# EasyEDA schematic SCH_CyBorg.json

## Sheets
1 CPU: TITLE: CyBorg - CPU, RAM, Bus; REV: 1.3; Date: 2022-11-21; Sheet: 1/6; Drawn By: Chris Brunner; Company: CyrusBuilt
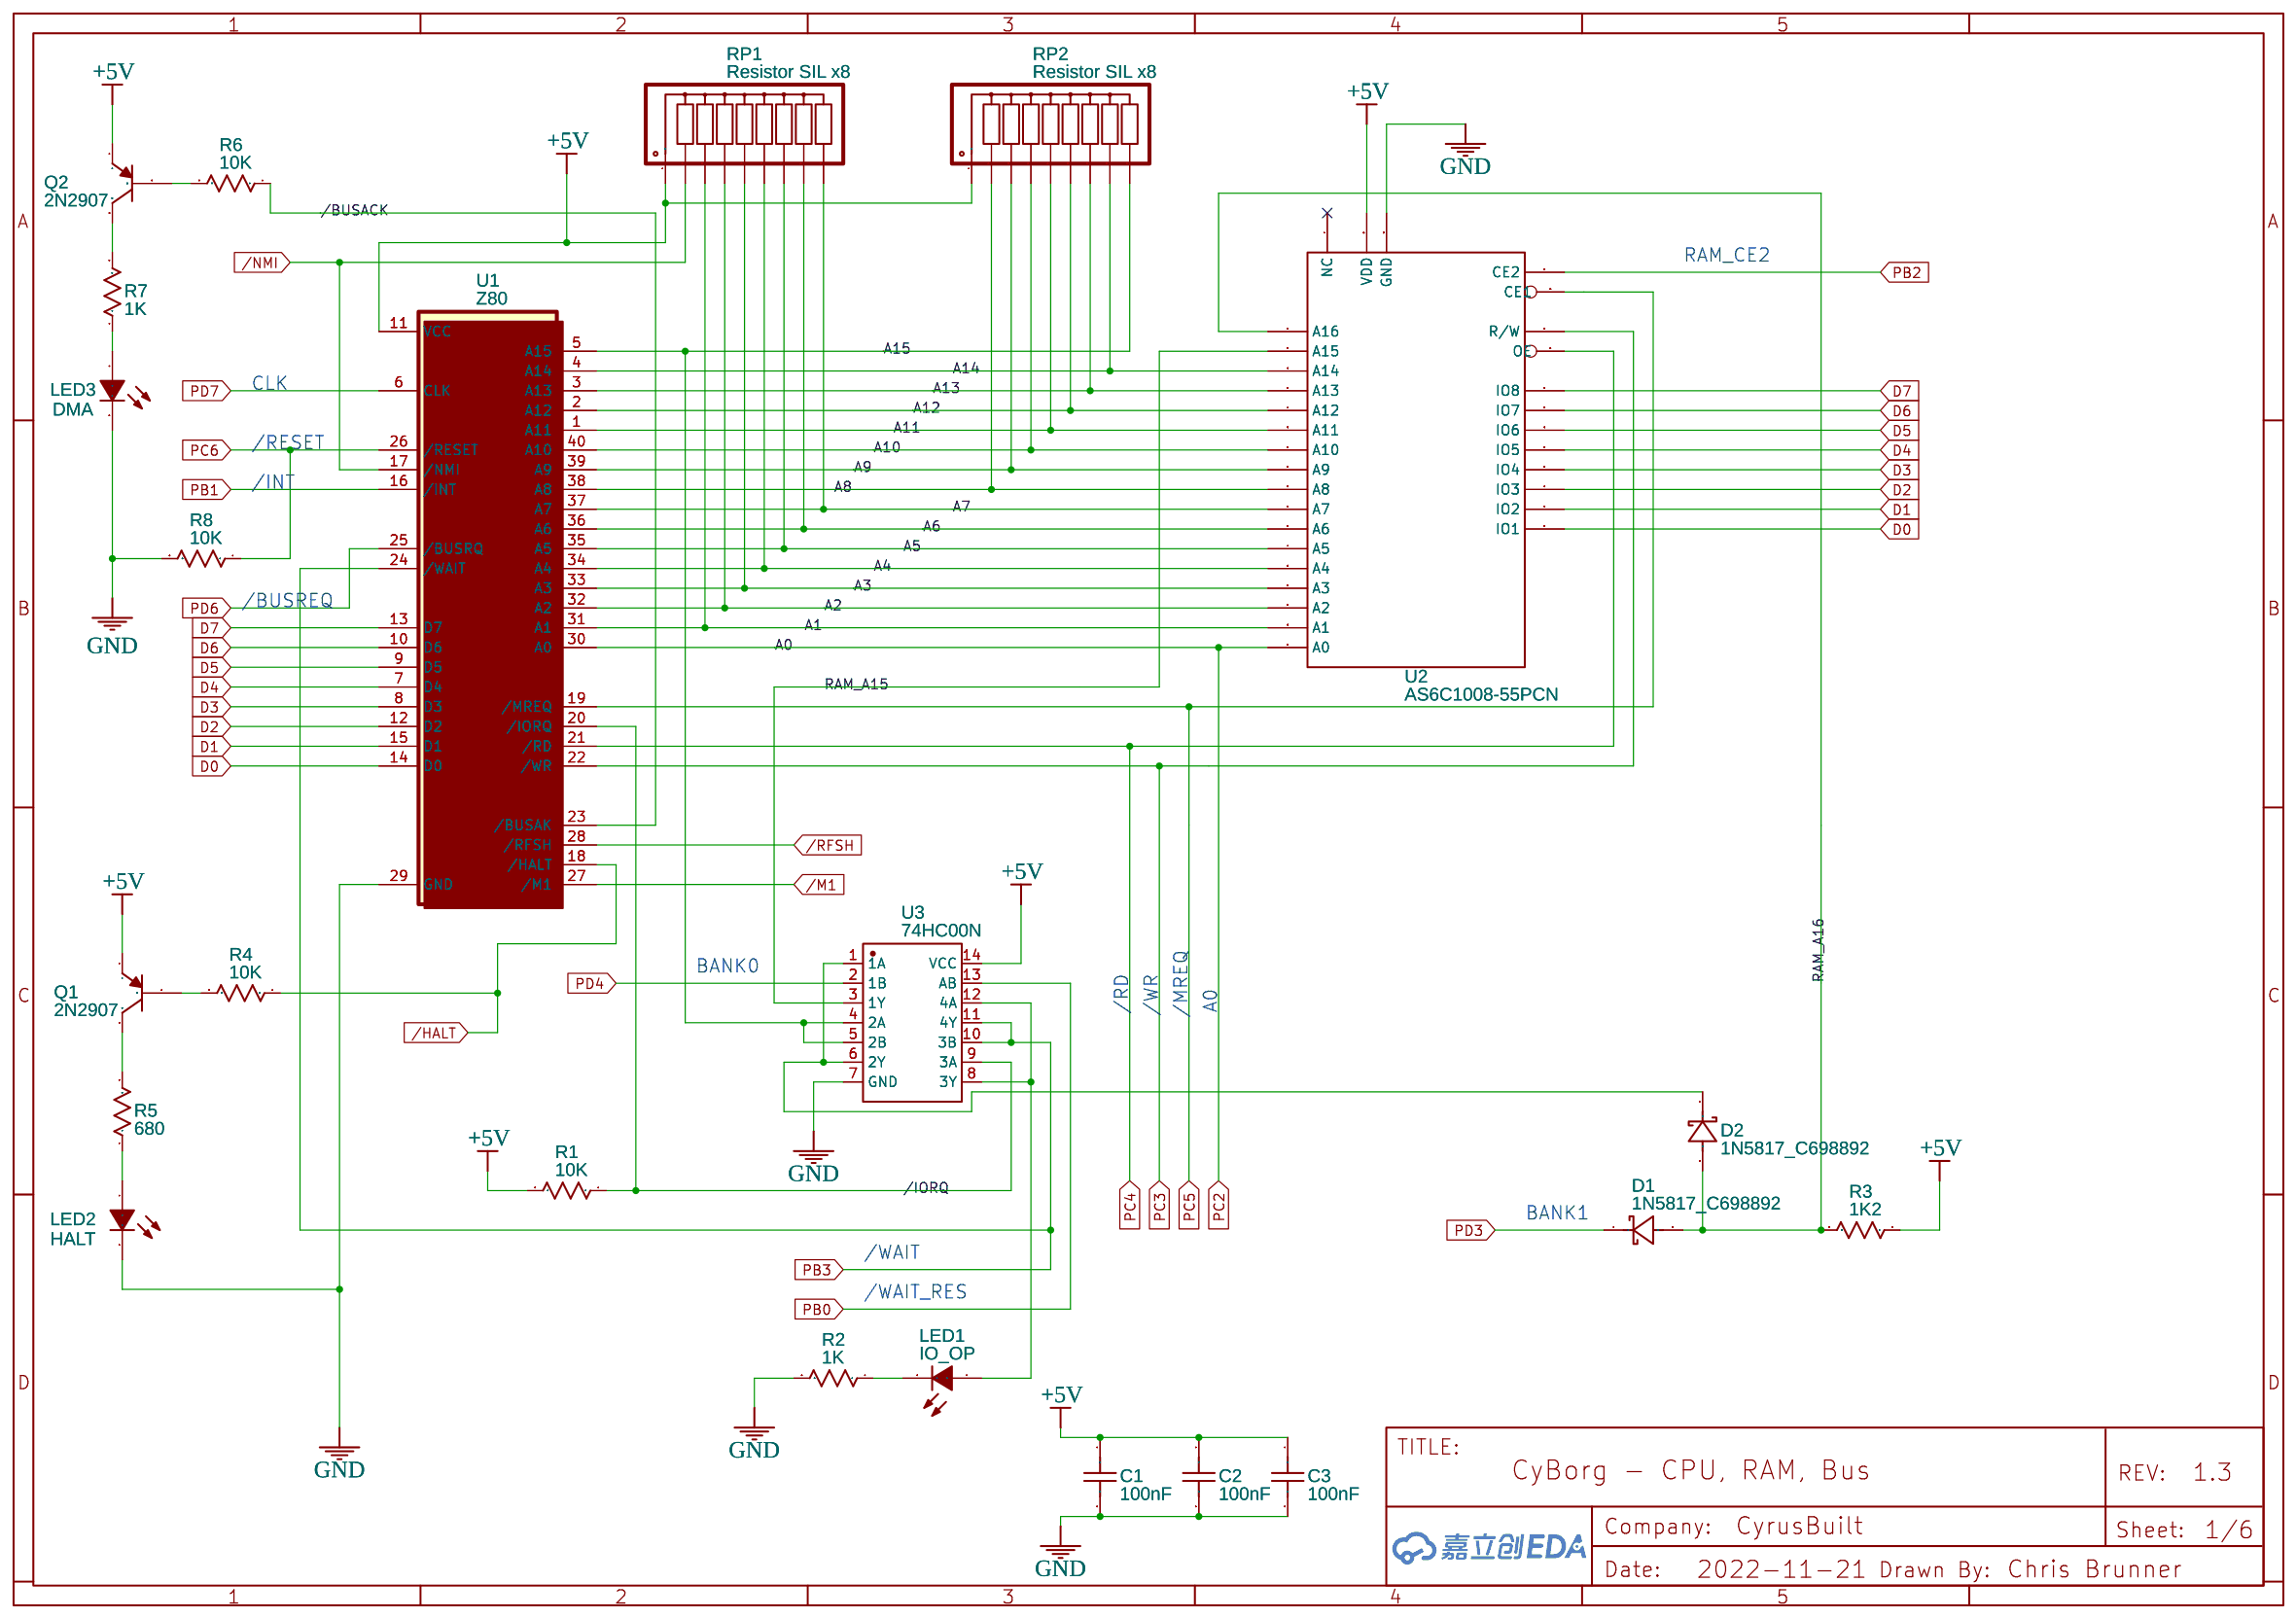
[diagram p0: CPU]
2 ViCREM: TITLE: CyBorg - ViCREM (Northbridge) and RTC; Date: 2022-11-22; Sheet: 2/6
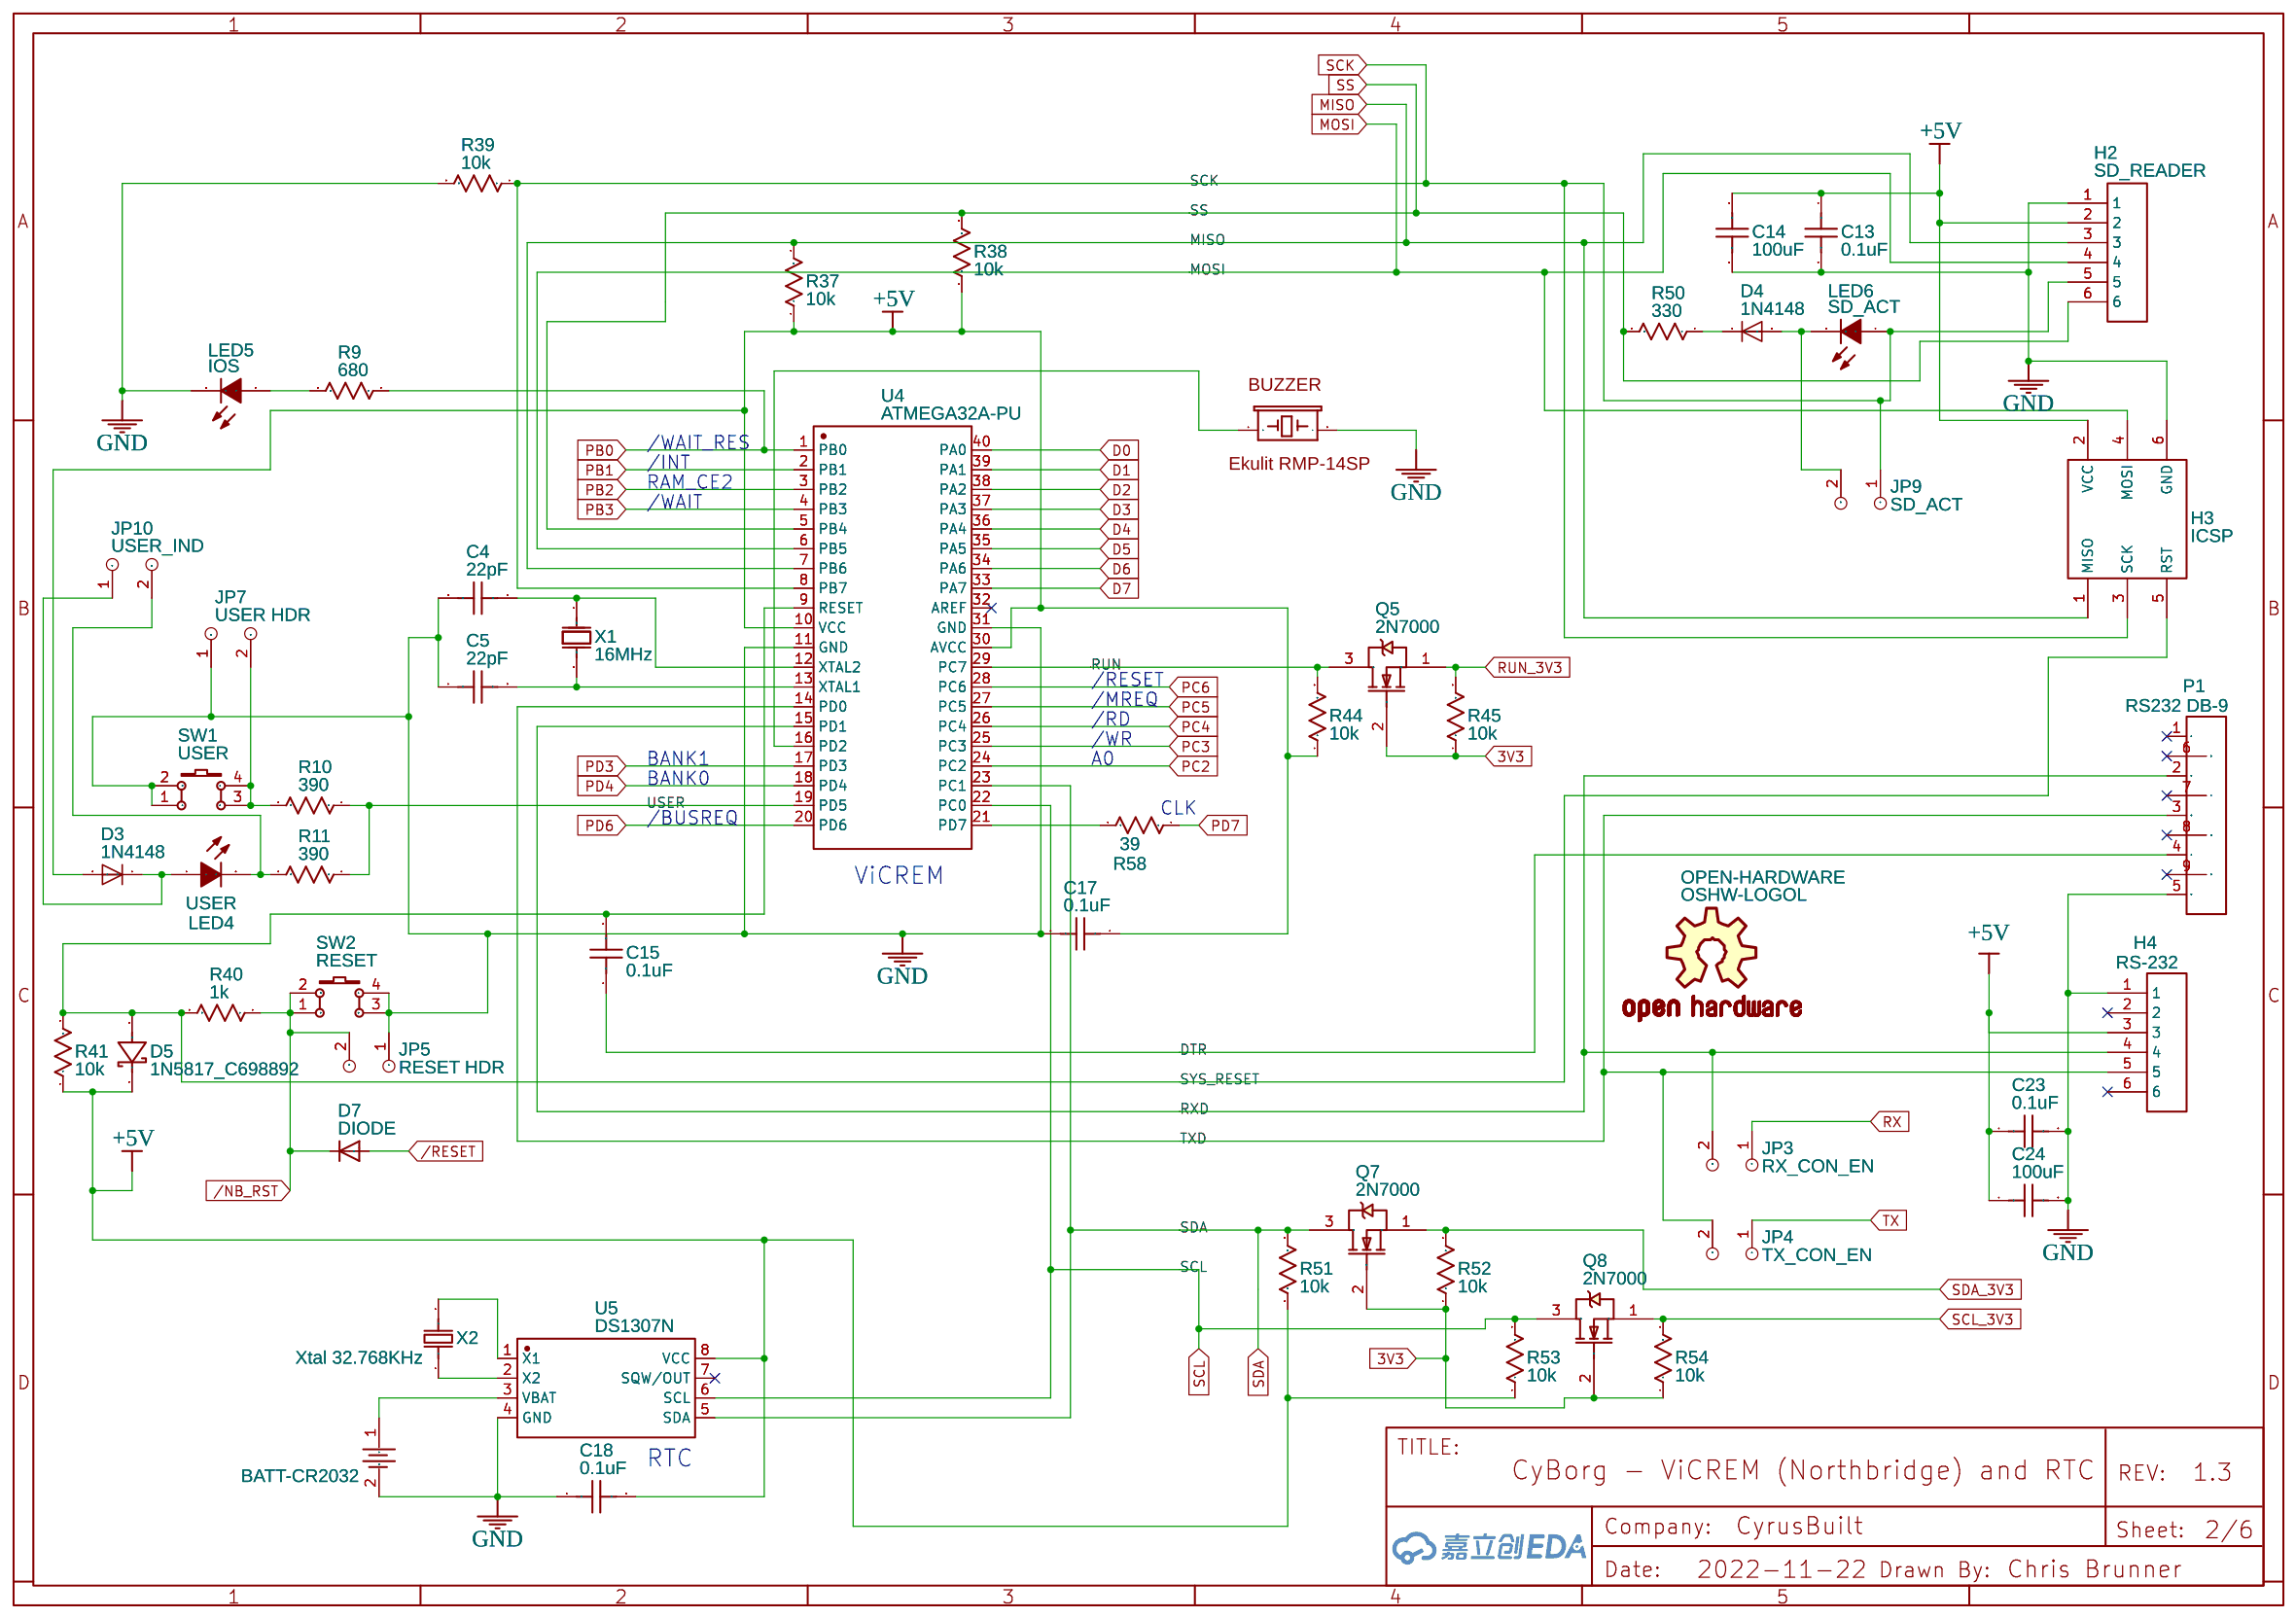
[diagram p1: ViCREM]
3 KAMVA - P1: TITLE: CyBorg - KAMVA (Southbridge) - MCU & VGA; Date: 2022-11-23; Sheet: 3/6
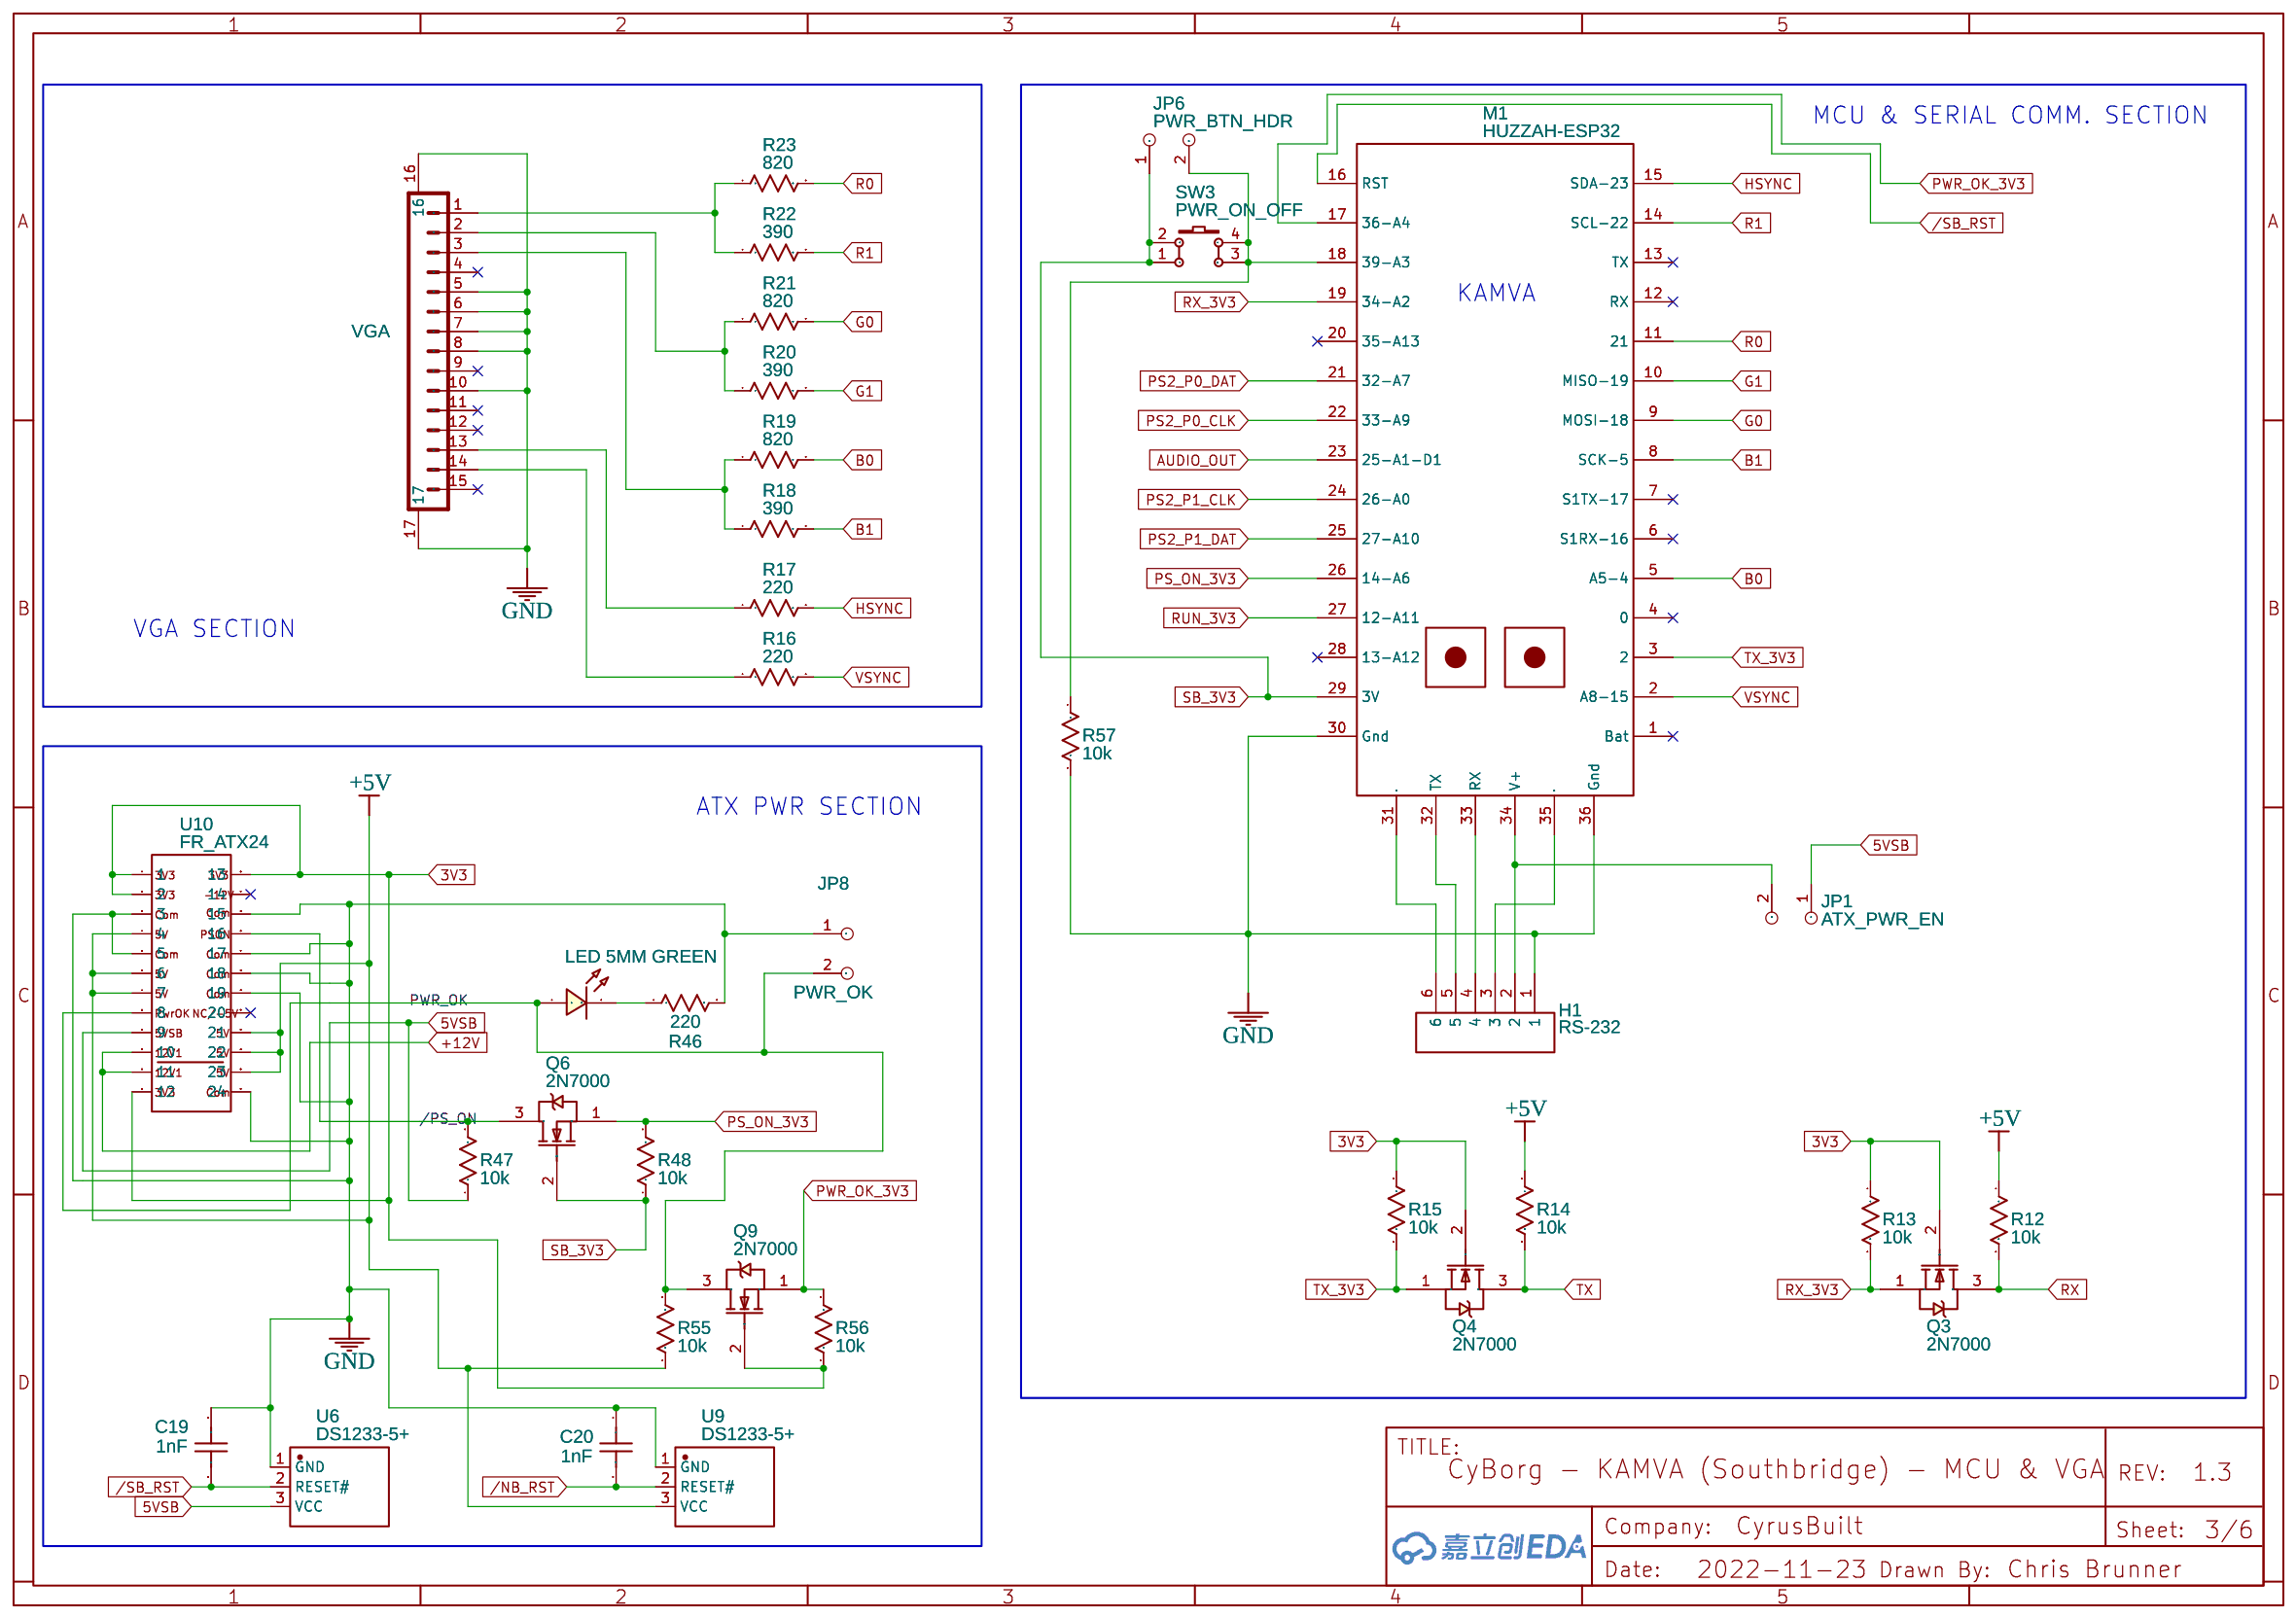
[diagram p2: KAMVA - P1]
4 KAMVA - P2: TITLE: CyBorg - KAMVA (Southbridge) - Audio & PS/2; Date: 2022-11-23; Sheet: 4/6
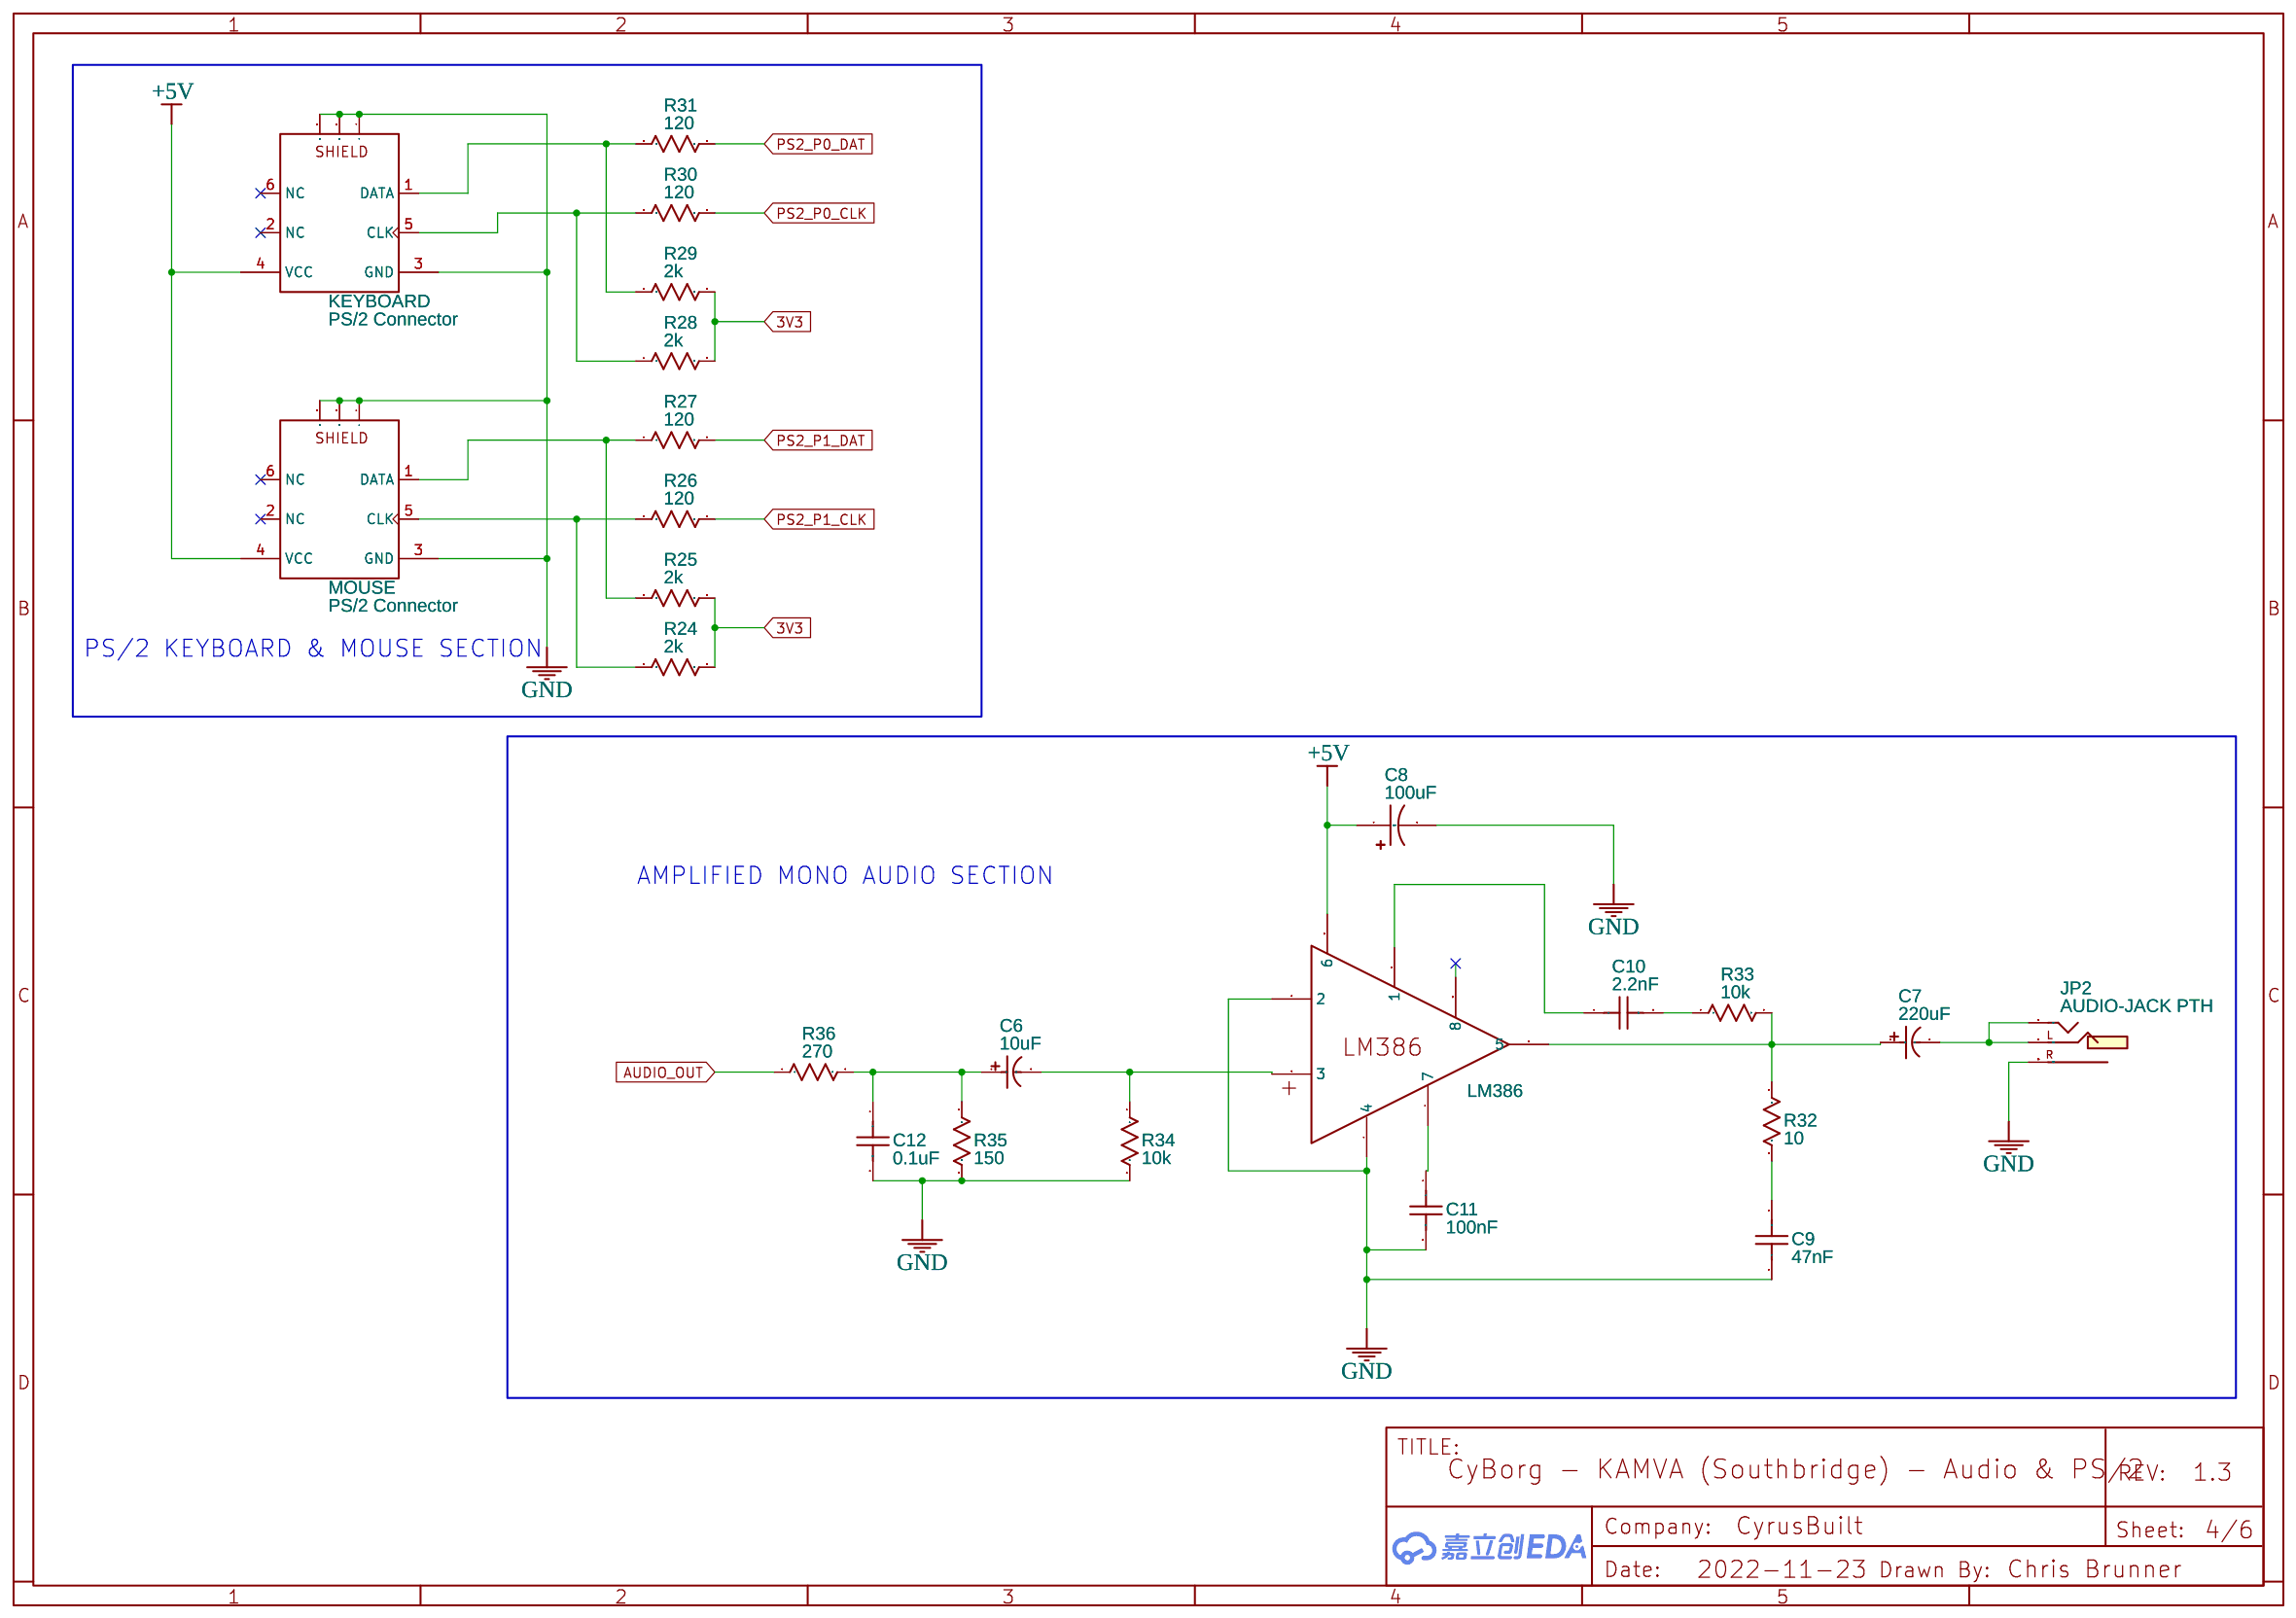
[diagram p3: KAMVA - P2]
5 Bus Control: TITLE: CyBorg - Bus Control; Date: 2022-11-24; Sheet: 5/6
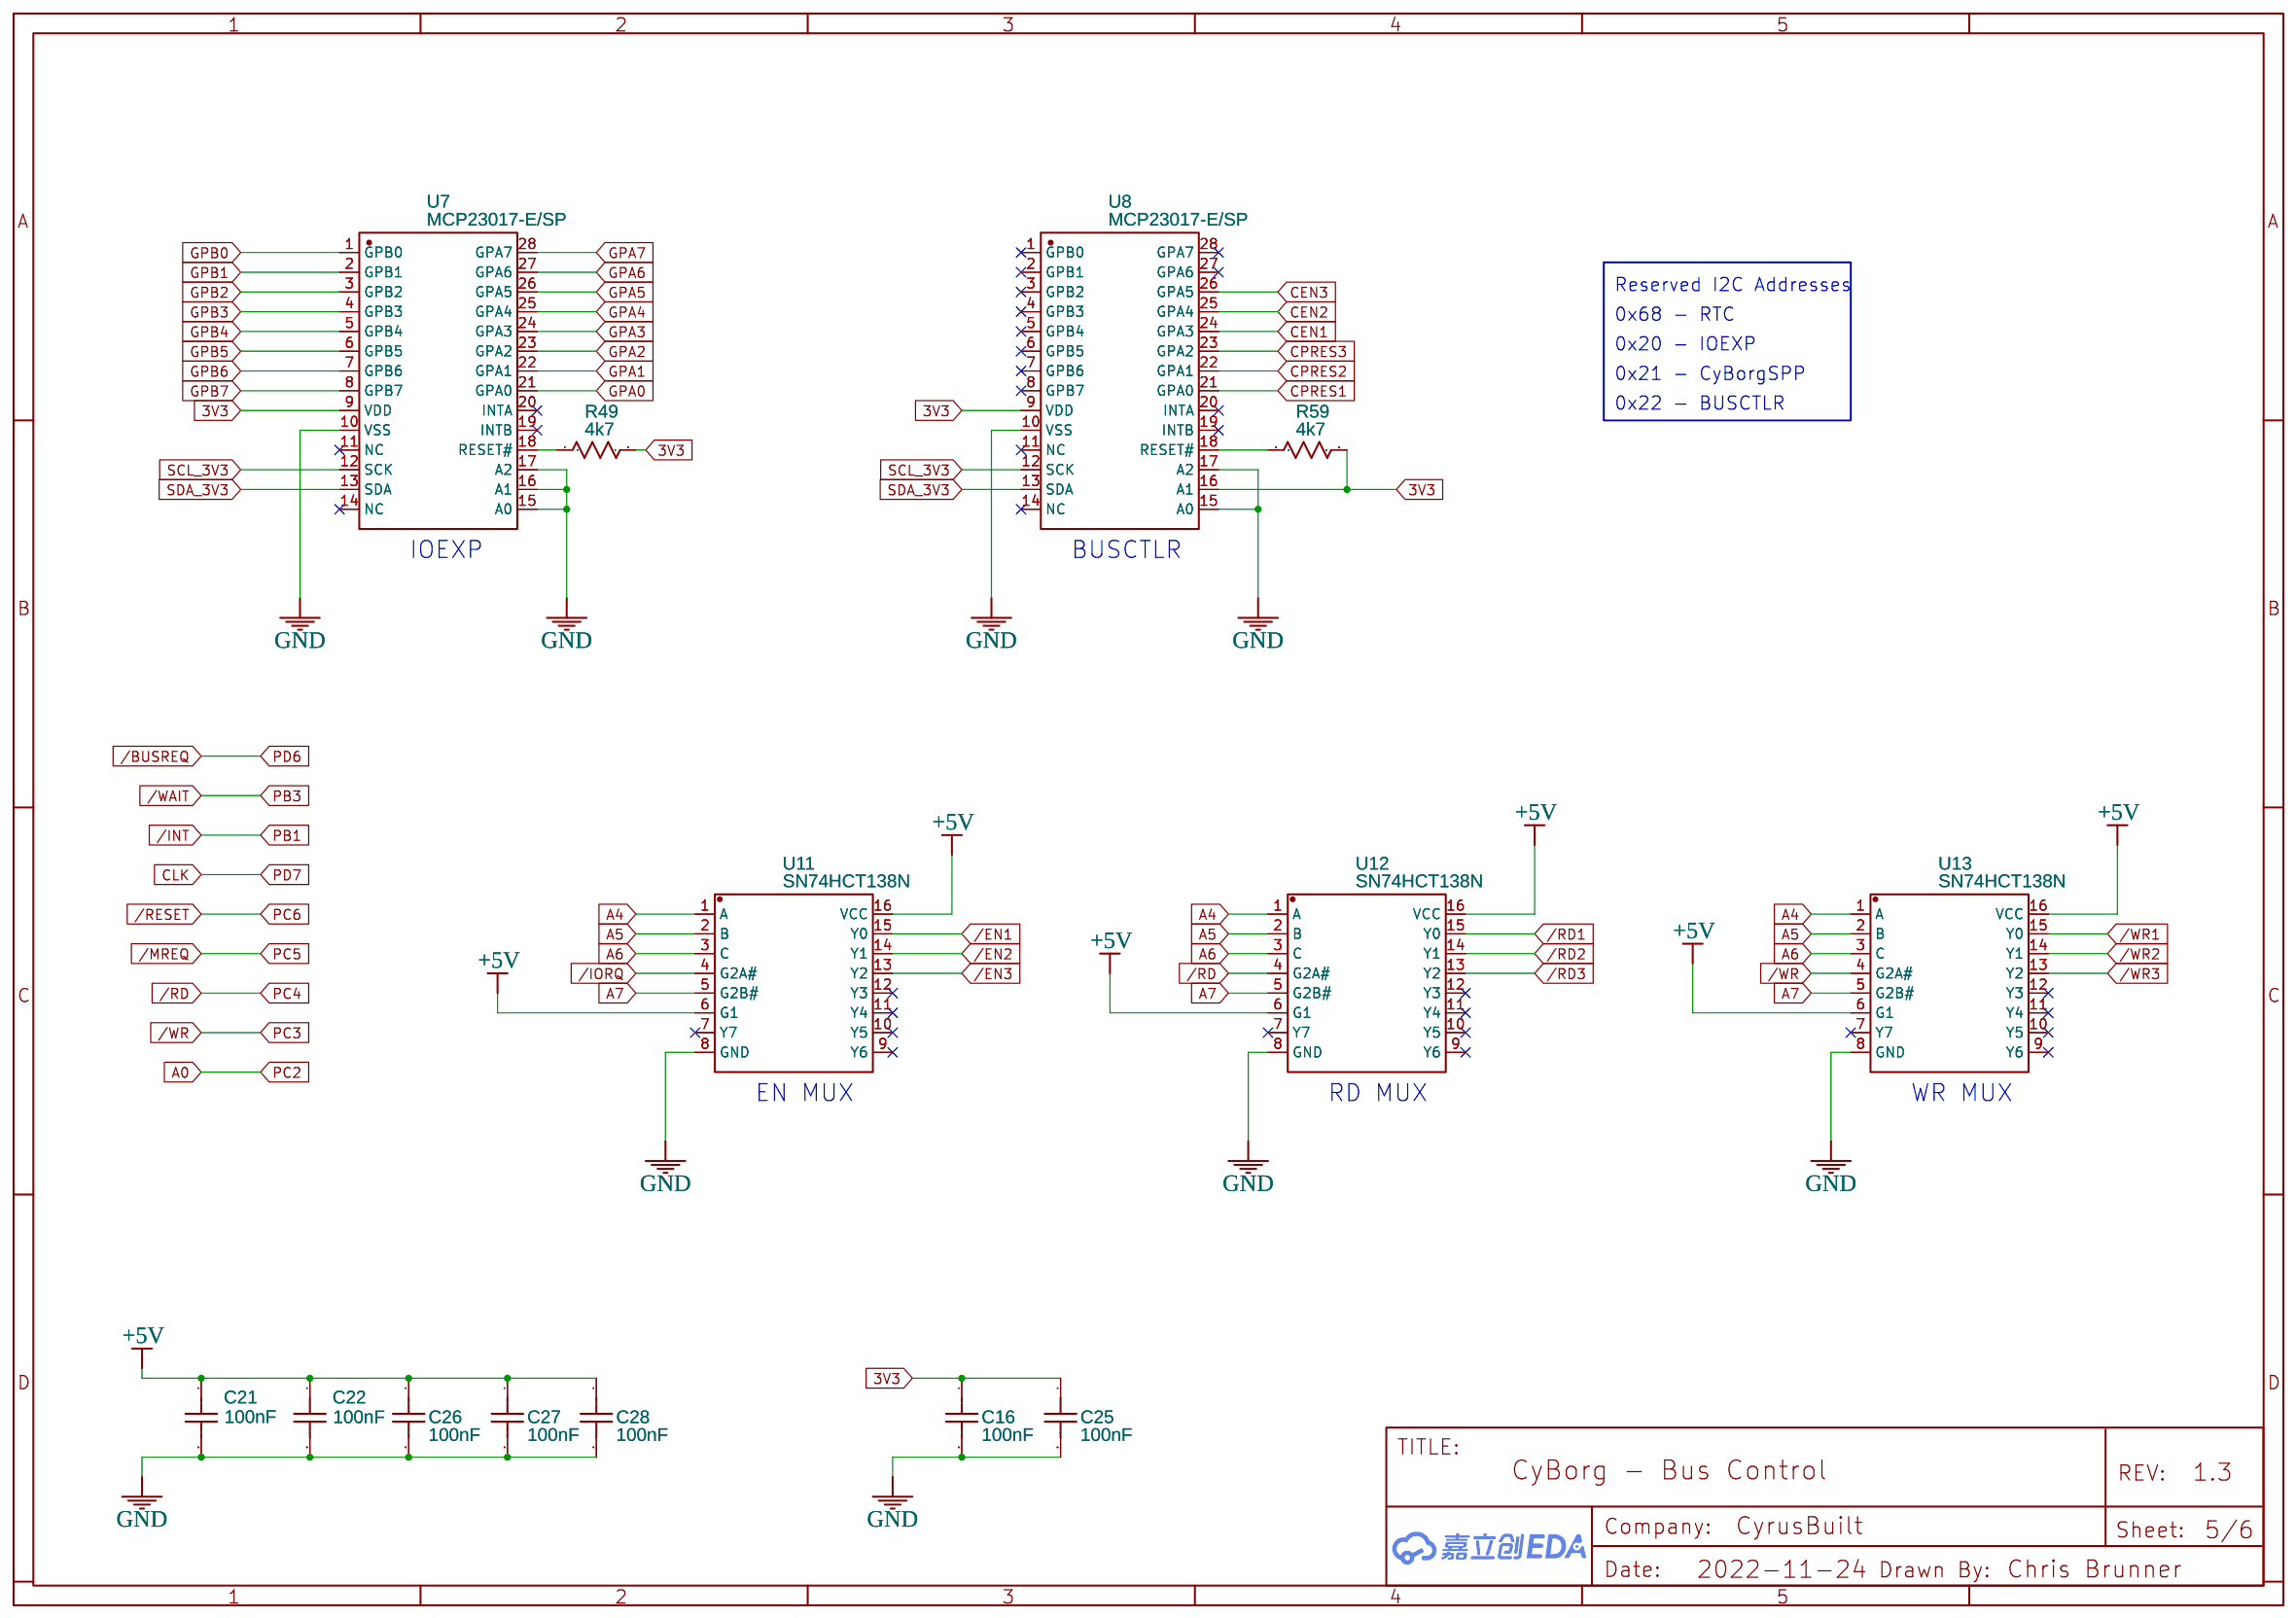
[diagram p4: Bus Control]
6 Expansion Bus: TITLE: CyBorg - Expansion Bus; Date: 2024-11-05; Sheet: 6/6
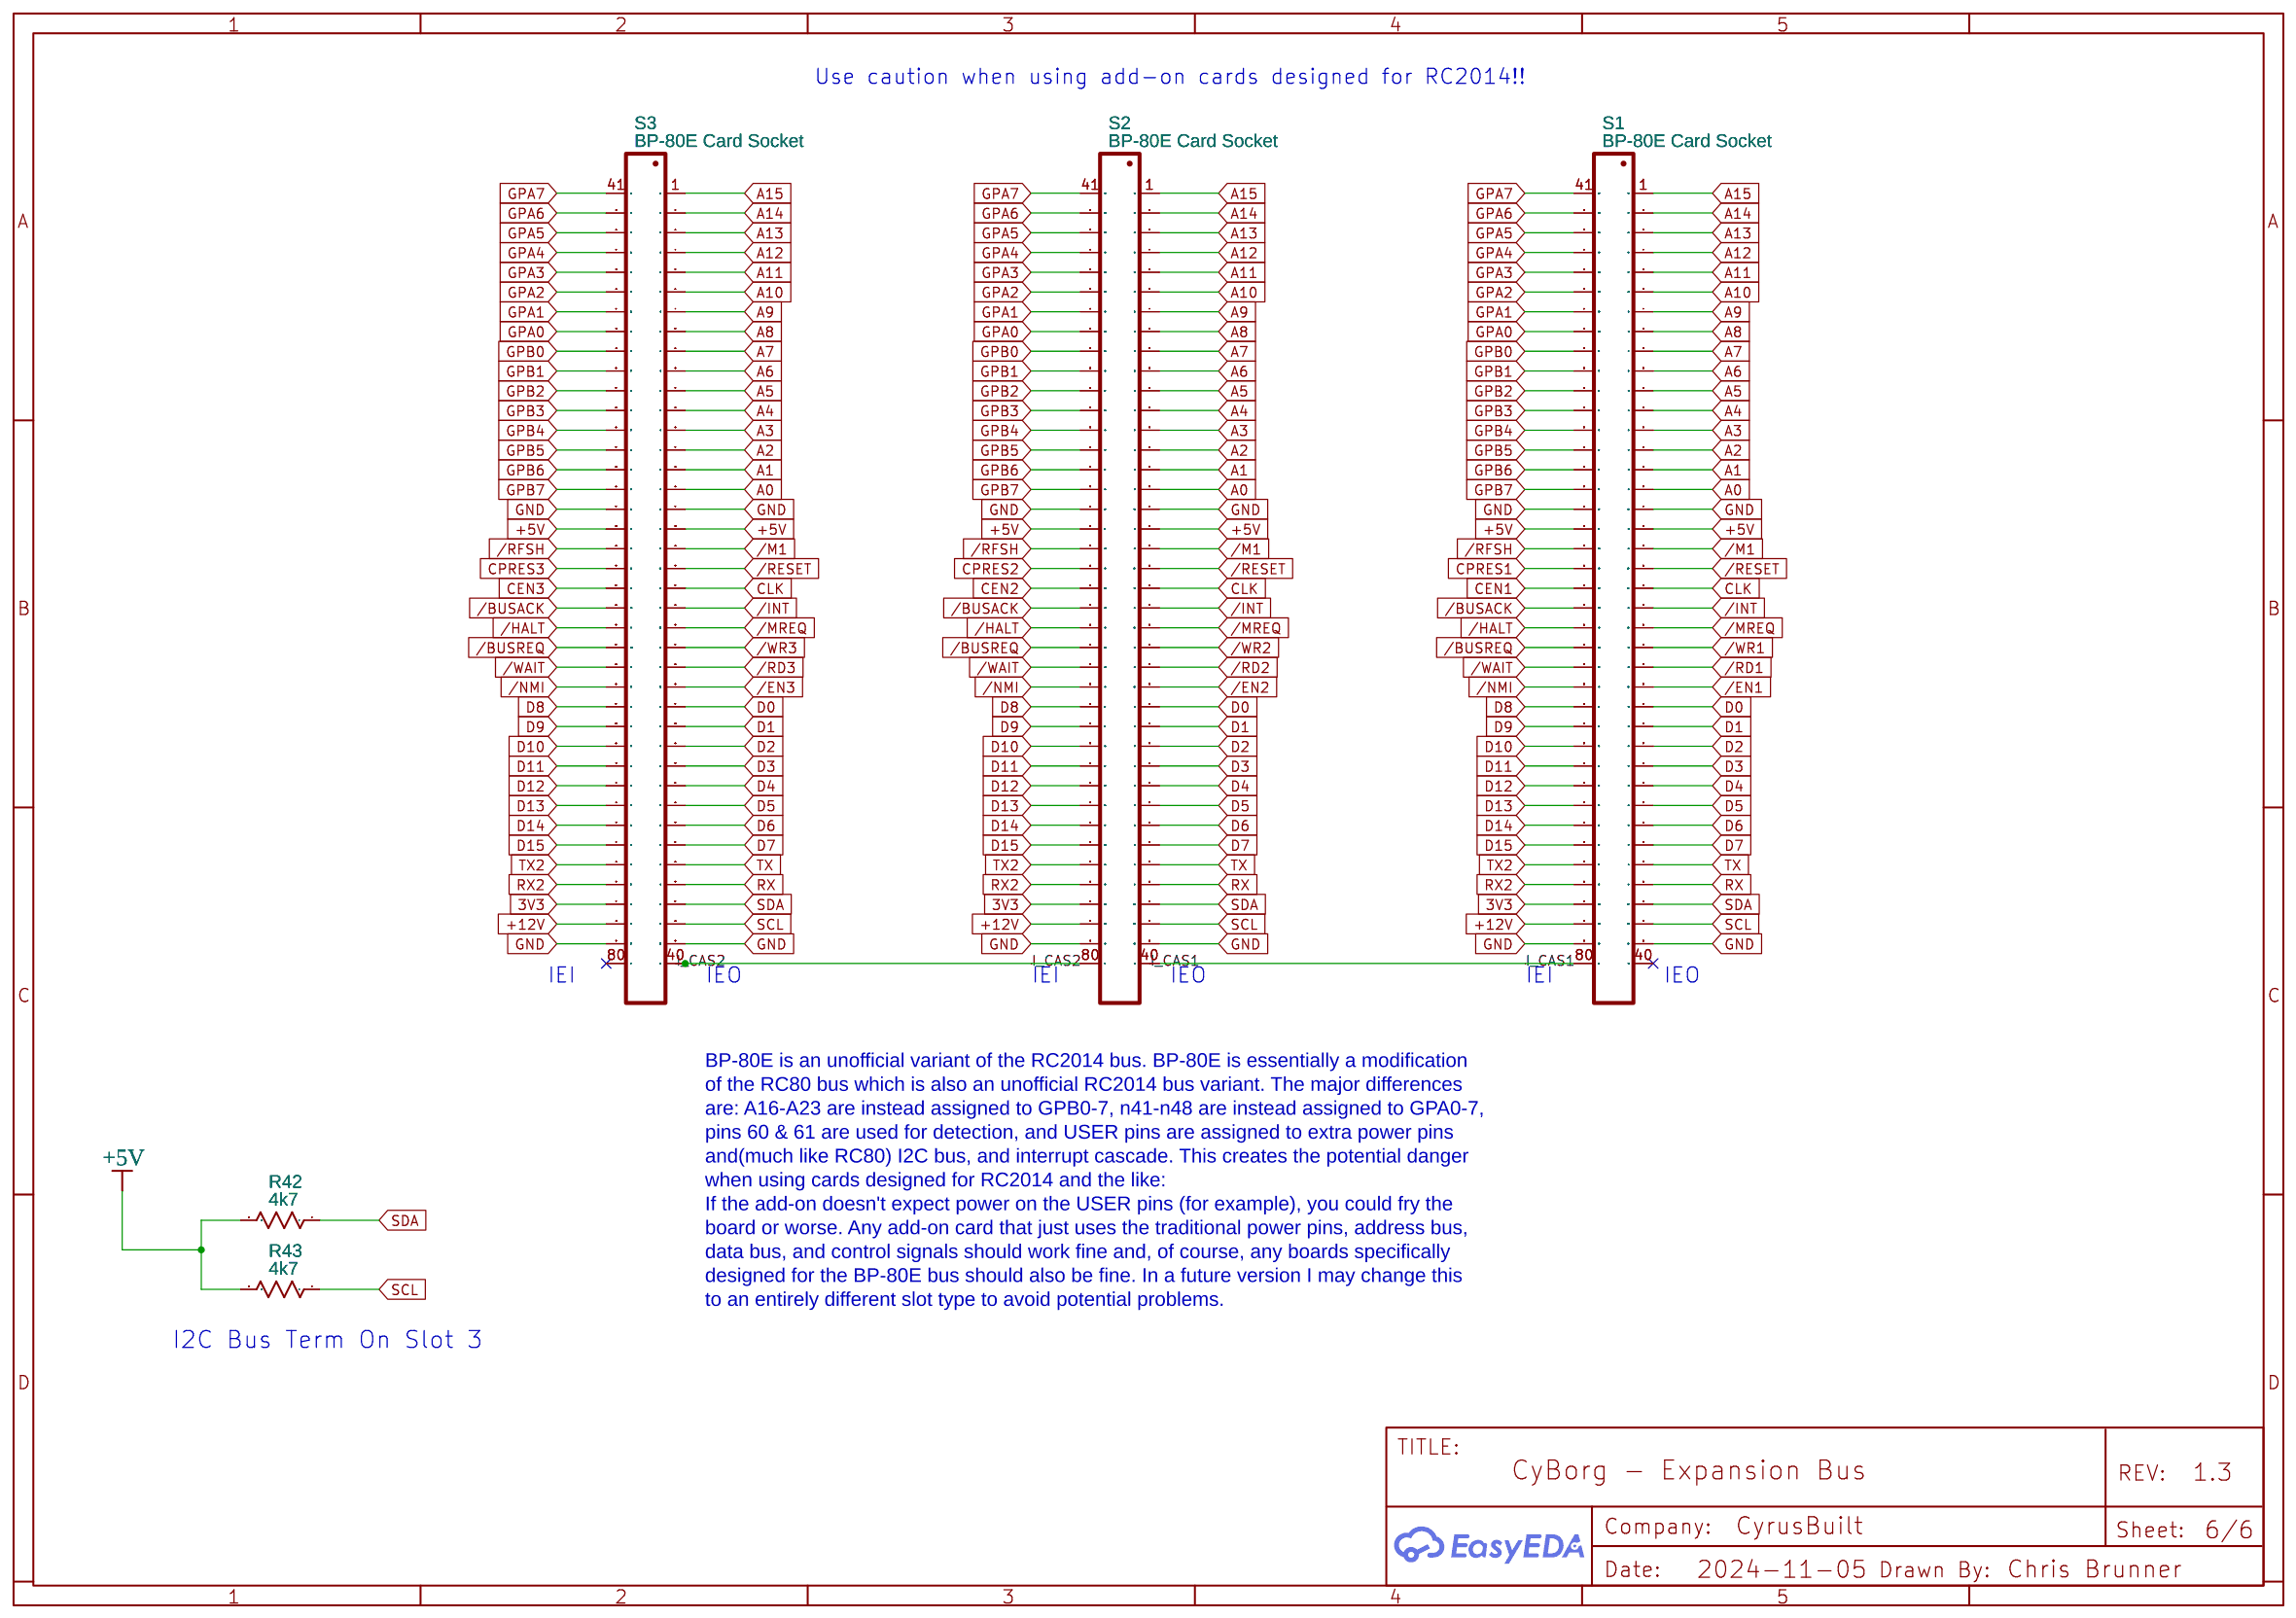
[diagram p5: Expansion Bus]

## Parts
sheet Bus Control
C16  100nF  [CAP-RAD-2.54MM]
C21  100nF  [CAP-RAD-2.54MM]
C22  100nF  [CAP-RAD-2.54MM]
C25  100nF  [CAP-RAD-2.54MM]
C26  100nF  [CAP-RAD-2.54MM]
C27  100nF  [CAP-RAD-2.54MM]
C28  100nF  [CAP-RAD-2.54MM]
R49  4k7  [PKG-0.25W RESISTOR]
R59  4k7  [PKG-0.25W RESISTOR]
U7  MCP23017-E/SP  [DIP-28_L35.0-W6.5-P2.54-LS7.6-BL]
U8  MCP23017-E/SP  [DIP-28_L35.0-W6.5-P2.54-LS7.6-BL]
U11  SN74HCT138N  [DIP-16_L19.2-W6.6-P2.54-LS7.6-BL]
U12  SN74HCT138N  [DIP-16_L19.2-W6.6-P2.54-LS7.6-BL]
U13  SN74HCT138N  [DIP-16_L19.2-W6.6-P2.54-LS7.6-BL]
sheet CPU
C1  100nF  [CAP-RAD-2.54MM]
C2  100nF  [CAP-RAD-2.54MM]
C3  100nF  [CAP-RAD-2.54MM]
D1  1N5817_C698892  [DO-41_BD2.4-L4.7-P8.70-D0.9-RD]
D2  1N5817_C698892  [DO-41_BD2.4-L4.7-P8.70-D0.9-RD]
LED1  IO_OP  [LED-TH_BD3.0-P2.54-FD]
LED2  HALT  [LED-TH_BD3.0-P2.54-FD]
LED3  DMA  [LED-TH_BD3.0-P2.54-FD]
Q1  2N2907  [TO-92-3_L5.1-W4.1-P1.27-L]
Q2  2N2907  [TO-92-3_L5.1-W4.1-P1.27-L]
R1  10K  [PKG-0.25W RESISTOR]
R2  1K  [PKG-0.25W RESISTOR]
R3  1K2  [PKG-0.25W RESISTOR]
R4  10K  [PKG-0.25W RESISTOR]
R5  680  [PKG-0.25W RESISTOR]
R6  10K  [PKG-0.25W RESISTOR]
R7  1K  [PKG-0.25W RESISTOR]
R8  10K  [PKG-0.25W RESISTOR]
RP1  Resistor SIL x8  [SIL-9]
RP2  Resistor SIL x8  [SIL-9]
U1  Z80  [DIP40]
U2  AS6C1008-55PCN  [DIP32]
U3  74HC00N  [DIP-14_L19.0-W7.0-P2.54-LS7.6-BL]
sheet Expansion Bus
R42  4k7  [PKG-0.25W RESISTOR]
R43  4k7  [PKG-0.25W RESISTOR]
S1  BP-80E Card Socket  [RC2014-HDR-2X40-S-F-R-2.54MM]
S2  BP-80E Card Socket  [RC2014-HDR-2X40-S-F-R-2.54MM]
S3  BP-80E Card Socket  [RC2014-HDR-2X40-S-F-R-2.54MM]
sheet KAMVA - P1
C19  1nF  [CAP-TH_L8.8-W3.6-P7.30-D0.5]
C20  1nF  [CAP-TH_L8.8-W3.6-P7.30-D0.5]
H1  RS-232  [HEADER-1X6-2.54MM]
JP1  ATX_PWR_EN  [HDR1X2]
JP6  PWR_BTN_HDR  [HDR1X2]
JP8  PWR_OK  [HDR1X2]
LED7  LED 5MM GREEN  [LED 5MM GREEN]
M1  HUZZAH-ESP32  [HUZZAH-ESP32]
Q3  2N7000  [2N7000 TO-92 B]
Q4  2N7000  [2N7000 TO-92 B]
Q6  2N7000  [2N7000 TO-92 B]
Q9  2N7000  [2N7000 TO-92 B]
R12  10k  [PKG-0.25W RESISTOR]
R13  10k  [PKG-0.25W RESISTOR]
R14  10k  [PKG-0.25W RESISTOR]
R15  10k  [PKG-0.25W RESISTOR]
R16  220  [PKG-0.25W RESISTOR]
R17  220  [PKG-0.25W RESISTOR]
R18  390  [PKG-0.25W RESISTOR]
R19  820  [PKG-0.25W RESISTOR]
R20  390  [PKG-0.25W RESISTOR]
R21  820  [PKG-0.25W RESISTOR]
R22  390  [PKG-0.25W RESISTOR]
R23  820  [PKG-0.25W RESISTOR]
R46  220  [PKG-0.25W RESISTOR]
R47  10k  [PKG-0.25W RESISTOR]
R48  10k  [PKG-0.25W RESISTOR]
R55  10k  [PKG-0.25W RESISTOR]
R56  10k  [PKG-0.25W RESISTOR]
R57  10k  [PKG-0.25W RESISTOR]
SW3  PWR_ON_OFF  [KEY-TH_4P-L6.0-W6.0-P4.50-LS6.5]
U6  DS1233-5+  [TO-92-3_L4.9-W3.7-P1.27-L]
U9  DS1233-5+  [TO-92-3_L4.9-W3.7-P1.27-L]
U10  FR_ATX24  [FR_ATX24]
VGA  VGA-001  [D-SUB-TH_VGA-002]
sheet KAMVA - P2
C6  10uF  [ELECTROLYTIC CAPACITOR]
C7  220uF  [220UF ELECTROLYTIC]
C8  100uF  [ELECTROLYTIC CAPACITOR 100UF]
C9  47nF  [CAP-TH_L8.8-W3.6-P7.30-D0.5]
C10  2.2nF  [CAP-TH_L8.8-W3.6-P7.30-D0.5]
C11  100nF  [CAP-TH_L8.8-W3.6-P7.30-D0.5]
C12  0.1uF  [CAP-TH_L8.8-W3.6-P7.30-D0.5]
JP2  AUDIO-JACK PTH  [AUDIO-JACK]
KEYBOARD  PS/2 Connector  [PS2_PORT]
LM386  LM386  [LM386]
MOUSE  PS/2 Connector  [PS2_PORT]
R24  2k  [PKG-0.25W RESISTOR]
R25  2k  [PKG-0.25W RESISTOR]
R26  120  [PKG-0.25W RESISTOR]
R27  120  [PKG-0.25W RESISTOR]
R28  2k  [PKG-0.25W RESISTOR]
R29  2k  [PKG-0.25W RESISTOR]
R30  120  [PKG-0.25W RESISTOR]
R31  120  [PKG-0.25W RESISTOR]
R32  10  [PKG-0.25W RESISTOR]
R33  10k  [PKG-0.25W RESISTOR]
R34  10k  [PKG-0.25W RESISTOR]
R35  150  [PKG-0.25W RESISTOR]
R36  270  [PKG-0.25W RESISTOR]
sheet ViCREM
C4  22pF  [CAP-RAD-2.54MM]
C5  22pF  [CAP-RAD-2.54MM]
C13  0.1uF  [CAP-RAD-2.54MM]
C14  100uF  [CAP-RAD-2.54MM]
C15  0.1uF  [CAP-RAD-2.54MM]
C17  0.1uF  [CAP-RAD-2.54MM]
C18  0.1uF  [CAP-RAD-2.54MM]
C23  0.1uF  [CAP-RAD-2.54MM]
C24  100uF  [CAP-RAD-2.54MM]
CR2032  BATT-CR2032  [BATT-CR2032]
D3  1N4148  [1N4148]
D4  1N4148  [1N4148]
D5  1N5817_C698892  [DO-41_BD2.4-L4.7-P8.70-D0.9-RD]
D7  DIODE  [DIODE-1N4001]
H2  SD_READER  [HEADER-1X6-2.54MM]
H3  ICSP  [ICSP - 1]
H4  RS-232  [HEADER-1X6-2.54MM]
JP3  RX_CON_EN  [HDR1X2]
JP4  TX_CON_EN  [HDR1X2]
JP5  RESET HDR  [HDR1X2]
JP7  USER HDR  [HDR1X2]
JP9  SD_ACT  [HDR1X2]
JP10  USER_IND  [HDR1X2]
LED4  USER  [LED-TH_BD3.0-P2.54-FD]
LED5  IOS  [LED-TH_BD3.0-P2.54-FD]
LED6  SD_ACT  [LED-TH_BD3.0-P2.54-FD]
OPEN-HARDWARE  OSHW-LOGOL  [OSHW-LOGO-L]
P1  RS232 DB-9  [DB9-TH_DB9-H-F_C2888345]
Q5  2N7000  [2N7000 TO-92 B]
Q7  2N7000  [2N7000 TO-92 B]
Q8  2N7000  [2N7000 TO-92 B]
R9  680  [PKG-0.25W RESISTOR]
R10  390  [PKG-0.25W RESISTOR]
R11  390  [PKG-0.25W RESISTOR]
R37  10k  [PKG-0.25W RESISTOR]
R38  10k  [PKG-0.25W RESISTOR]
R39  10k  [PKG-0.25W RESISTOR]
R40  1k  [PKG-0.25W RESISTOR]
R41  10k  [PKG-0.25W RESISTOR]
R44  10k  [PKG-0.25W RESISTOR]
R45  10k  [PKG-0.25W RESISTOR]
R50  330  [PKG-0.25W RESISTOR]
R51  10k  [PKG-0.25W RESISTOR]
R52  10k  [PKG-0.25W RESISTOR]
R53  10k  [PKG-0.25W RESISTOR]
R54  10k  [PKG-0.25W RESISTOR]
R58  39  [PKG-0.25W RESISTOR]
SPK  BUZZER Ekulit RMP-14SP  [BUZZER-R14-2P-7.6PITCH]
SW1  USER  [KEY-TH_4P-L6.0-W6.0-P4.50-LS6.5]
SW2  RESET  [KEY-TH_4P-L6.0-W6.0-P4.50-LS6.5]
U4  ATMEGA32A-PU  [DIP-40_L52.3-W13.9-P2.54-LS15.2-BL]
U5  DS1307N  [DIP-8_L9.8-W6.6-P2.54-LS7.6-BL]
X1  16MHz  [OSC-TH_L10.0-W4.5-P5.00]
X2  Xtal 32.768KHz  [XTAL 32.768KHZ]

## Library data of the parts
C1-C5 C13-C18 C21-C28 = C_0603_US: Contributor: LCEDA_Lib
R1 R3-R49 R51-R57 R59 = MCF 0.25W 150R: Power: 1/4W; Tolerance: ±5%; Supplier Part: 9339175; Supplier: Element14; Manufacturer: MULTICOMP; link: http://www.farnell.com/datasheets/2861447.pdf; Contributor: Prof. Ing. F. Scordino
U7 U8 = MCP23017-E/SP: Supplier: LCSC; Supplier Part: C647352; Manufacturer: Microchip Tech; Contributor: LCSC; JLCPCB Part Class: Extended Part
U11-U13 = SN74HCT138N: Contributor: LCSC; Supplier: LCSC; Supplier Part: C67461; Manufacturer: TI(德州仪器); JLCPCB Part Class: Extended Part
D1 D2 D5 = 1N5817_C698892: Supplier: LCSC; Supplier Part: C698892; Manufacturer: YANGJIE(扬杰); Manufacturer Part: 1N5817; Contributor: LCSC; JLCPCB Part Class: Extended Part
LED1-LED6 = 204-10SURD/S530-A3: Supplier: LCSC; Manufacturer: EVERLIGHT(亿光); Supplier Part: C99772; JLCPCB Part Class: Extended Part
Q1 Q2 = 2N2907: Supplier: LCSC; Manufacturer: ST(先科); Manufacturer Part: 2N2907A; Supplier Part: C118537; JLCPCB Part Class: Extended Part
R2 = MCF 0.25W 150R: Power: 1/4W; Tolerance: ±5%; Supplier Part: 9339175; Supplier: Element14; Manufacturer: MULTICOMP; Manufacturer Part: MCF 0.25W 1K; link: http://www.farnell.com/datasheets/2861447.pdf; Contributor: Prof. Ing. F. Scordino
RP1 RP2 = Resistor SIL x8: Contributor: sccousins; license: https://www.gnu.org/licenses/lgpl-2.1.html
U1 = Z80: Manufacturer Part: Z84C0008PEG; Contributor: sorinfxdx
U2 = TC551001BPL: Contributor: Duffyevan
U3 = 74HC00N: Supplier: LCSC; Supplier Part: C596352; Manufacturer: HTC Korea TAEJIN Tech; Contributor: LCSC; JLCPCB Part Class: Extended Part
S1-S3 = RC80 Card Socket
C9-C12 C19 C20 = 0.1UF/250V: Supplier: LCSC; Supplier Part: C9900015263; Manufacturer: null; Manufacturer Part: 0.1uF/250V; JLCPCB Part Class: Extended Part; Contributor: lcsc
H1 H2 H4 = HEADER 1X6: Contributor: Mimosa
JP1 JP3-JP10 = 2 Pin Header: Contributor: Adafruit; sourceId: 0SMGAR9rl
LED7 = LED 5MM GREEN: Contributor: LCSC
M1 = HUZZAH-ESP32: Contributor: BrIs1063
Q3-Q9 = 2N7000: Small Signal MOSFET, 200 mA, 60 V, N-Channel, 3-Pin TO-92, Bulk Box
SW1-SW3 = K4-6×6_TH: Supplier: LCSC; Supplier Part: C136684; Manufacturer: 韩国韩荣; Manufacturer Part: K2-1102DP-E4SW-04; Contributor: LCEDA_Lib
U6 U9 = DS1233-10+: Supplier: LCSC; Supplier Part: C474045; Manufacturer: Maxim Integrated; Contributor: LCSC; JLCPCB Part Class: Extended Part
U10 = FR_ATX24: Manufacturer Part: ATX-24; Contributor: H477
VGA = VGA-002: Supplier: LCSC; Manufacturer: BOOMELE(博穆精密); Supplier Part: C138387; JLCPCB Part Class: Extended Part
C6 = electrolytic capacitor: Supplier: LCSC; Manufacturer: ValuePro; Manufacturer Part: electrolytic capacitor 10UF 50V high frequency; Supplier Part: C78759; Contributor: elnino
C7 = 220uF: Manufacturer: ValuePro; Manufacturer Part: Aluminum electrolytic capacitors47uF 63V 20% High frequency green gold; Supplier Part: C60712; JLCPCB Part Class: Extended Part; Contributor: Gareth Parsons
C8 = 100uF: Contributor: Atly Joy
JP2 = AUDIO-JACKPTH COPY: 3.5mm Audio Jack; Contributor: SparkFun
KEYBOARD MOUSE = PS/2 Connector: Contributor: Peter2022
LM386 = LM386: Manufacturer: LM386N-1/NOPB; Manufacturer Part: LM386N-1/NOPB; Supplier: Digi-Key; link: https://www.digikey.com/es/products/detail/texas-instruments/LM386N-1-NOPB/6284; Contributor: angelemus005
CR2032 = BATT-CR2032
D3 D4 = 1N4148: Contributor: mid150; license: https://www.gnu.org/licenses/lgpl-2.1.html
D7 = DIODE: Contributor: SparkFun
H3 = ICSP - 1: Contributor: j0hann
OPEN-HARDWARE = OSHW-LOGOL: Contributor: SebSebSeb
P1 = RS232 9 pin Serial connection: Supplier: LCSC; Supplier Part: C9900003665; Manufacturer: null; Manufacturer Part: RS232DB99pin90度母座; Contributor: Aswath Ashok; JLCPCB Part Class: Extended Part
R50 R58 = MCF 0.25W 150R: Power: 1/4W; Tolerance: ±5%; Supplier Part: 9339175; Supplier: Element14; Manufacturer: MULTICOMP; Manufacturer Part: MCF 0.25W 330R; link: http://www.farnell.com/datasheets/2861447.pdf; Contributor: Prof. Ing. F. Scordino
SPK = BUZZER Ekulit RMP-14SP: Manufacturer: Ekulit; Supplier Part: RMP-14SP; Contributor: bkastrup
U4 = ATMEGA32A-PU: Supplier: LCSC; Manufacturer: MICROCHIP; Supplier Part: C12703; JLCPCB Part Class: Extended Part
U5 = DS1307N: Supplier: LCSC; Supplier Part: C434596; Manufacturer: HGSEMI; Contributor: LCSC; JLCPCB Part Class: Extended Part
X1 = X49SD16MSD2SC: Supplier: LCSC; Manufacturer: YXC(扬兴晶振); Supplier Part: C16212; JLCPCB Part Class: Extended Part
X2 = Xtal 32.768KHz: Contributor: mid150

## Nets
3V3: C16.1 C25.1 Q3.2(G) Q4.2(G) Q5.2(G) Q7.2(G) Q8.2(G) Q9.2(G) R13.1 R15.2 R24.2 R25.2 R28.2 R29.2 R45.1 R49.2 R52.1 R54.1 R56.1 R59.2 S1.77(USR5) S2.77(USR5) S3.77(USR5) U7.9(VDD) U8.9(VDD) U8.16(A1) U10.1 U10.2 U10.12 U10.13
5VSB: JP1.1 R47.1 U6.3(VCC) U10.9
+5V: C1.1 C2.1 C3.1 C8.1 C13.1 C14.1 C17.1 C18.2 C21.1 C22.1 C23.1 C24.1 C26.1 C27.1 C28.1 D3.2(A) D5.1 H2.2 H3.2(VCC) H4.3 KEYBOARD.4(VCC) LM386.6 MOUSE.4(VCC) Q1.1(E) Q2.1(E) R1.2 R3.1 R12.1 R14.1 R37.1 R38.1 R41.1 R42.2 R43.2 R44.1 R51.1 R53.1 R55.1 RP1.1(Com) RP2.1(Com) S1.18(5V) S1.58(5V) S2.18(5V) S2.58(5V) S3.18(5V) S3.58(5V) U1.11(VCC) U2.32(VDD) U3.14(VCC) U4.10(VCC) U4.30(AVCC) U5.8(VCC) U9.3(VCC) U10.4 U10.6 U10.7 U10.21 U10.22 U10.23 U11.6(G1) U11.16(VCC) U12.6(G1) U12.16(VCC) U13.6(G1) U13.16(VCC)
+12V: S1.78(USR6) S2.78(USR6) S3.78(USR6) U10.10 U10.11
GND: C1.2 C2.2 C3.2 C4.2 C5.1 C8.2 C9.2 C11.2 C12.2 C13.2 C14.2 C16.2 C17.2 C18.1 C19.1 C20.1 C21.2 C22.2 C23.2 C24.2 C25.2 C26.2 C27.2 C28.2 CR2032.2 H1.1 H2.1 H3.6(GND) H4.1 JP2.SLEEVE JP5.1 JP7.1 JP8.1 KEYBOARD.3(GND) KEYBOARD.7 KEYBOARD.8 KEYBOARD.9 LED2.2(K) LED3.2(K) LED5.2(K) LM386.2 LM386.4 M1.30(Gnd) M1.36(Gnd) MOUSE.3(GND) MOUSE.7 MOUSE.8 MOUSE.9 P1.5 R2.2 R8.2 R34.2 R35.2 R39.2 R46.2 R57.2 S1.17(GND) S1.39(USR3) S1.57(GND) S1.79(USR7) S2.17(GND) S2.39(USR3) S2.57(GND) S2.79(USR7) S3.17(GND) S3.39(USR3) S3.57(GND) S3.79(USR7) SPK.2(-) SW1.1 SW1.2 SW2.3 SW2.4 U1.29(GND) U2.16(GND) U3.7(GND) U4.11(GND) U4.31(GND) U5.4(GND) U6.1(GND) U7.10(VSS) U7.15(A0) U7.16(A1) U7.17(A2) U8.10(VSS) U8.15(A0) U8.17(A2) U9.1(GND) U10.3 U10.5 U10.15 U10.17 U10.18 U10.19 U10.24 U11.8(GND) U12.8(GND) U13.8(GND) VGA.5 VGA.6 VGA.7 VGA.8 VGA.10 VGA.16 VGA.17
/BUSACK: R6.1 S1.62(/BUSAK) S2.62(/BUSAK) S3.62(/BUSAK) U1.23(/BUSAK)
/BUSREQ: S1.64(/BUSRQ) S2.64(/BUSRQ) S3.64(/BUSRQ) U1.25(/BUSRQ) U4.20(PD6)
/EN1: S1.26(/IORQ) U11.15(Y0)
/EN2: S2.26(/IORQ) U11.14(Y1)
/EN3: S3.26(/IORQ) U11.13(Y2)
/HALT: R4.1 S1.63(/HALT) S2.63(/HALT) S3.63(/HALT) U1.18(/HALT)
/INT: S1.22(/INT) S2.22(/INT) S3.22(/INT) U1.16(/INT) U4.2(PB1)
/IORQ: R1.1 U1.20(/IORQ) U3.9(3A) U11.4(G2A#)
/M1: S1.19(/M1) S2.19(/M1) S3.19(/M1) U1.27(/M1)
/MREQ: S1.23(/MREQ) S2.23(/MREQ) S3.23(/MREQ) U1.19(/MREQ) U2.22(CE1) U4.27(PC5)
/NB_RST: C20.2 D7.C JP5.2 R40.1 SW2.1 SW2.2 U9.2(RESET#)
/NMI: RP1.2 S1.66(/NMI) S2.66(/NMI) S3.66(/NMI) U1.17(/NMI)
/PS_ON: Q6.3(D) R47.2 U10.16
/RD: U1.21(/RD) U2.24(OE) U4.26(PC4) U12.4(G2A#)
/RD1: S1.25(/RD) U12.15(Y0)
/RD2: S2.25(/RD) U12.14(Y1)
/RD3: S3.25(/RD) U12.13(Y2)
/RESET: D7.A R8.1 S1.20(/RESET) S2.20(/RESET) S3.20(/RESET) U1.26(/RESET) U4.28(PC6)
/RFSH: S1.59(/RFSH) S2.59(/RFSH) S3.59(/RFSH) U1.28(/RFSH)
/SB_RST: C19.2 M1.16(RST) U6.2(RESET#)
/WAIT: S1.65(/WAIT) S2.65(/WAIT) S3.65(/WAIT) U1.24(/WAIT) U3.10(3B) U3.11(4Y) U4.4(PB3)
/WR: U1.22(/WR) U2.29(R/W) U4.25(PC3) U13.4(G2A#)
/WR1: S1.24(/WR) U13.15(Y0)
/WR2: S2.24(/WR) U13.14(Y1)
/WR3: S3.24(/WR) U13.13(Y2)
A0: S1.16(A0) S2.16(A0) S3.16(A0) U1.30(A0) U2.11(A0) U4.24(PC2)
A1: RP1.3 S1.15(A1) S2.15(A1) S3.15(A1) U1.31(A1) U2.10(A1)
A2: RP1.4 S1.14(A2) S2.14(A2) S3.14(A2) U1.32(A2) U2.9(A2)
A3: RP1.5 S1.13(A3) S2.13(A3) S3.13(A3) U1.33(A3) U2.15(A3)
A4: RP1.6 S1.12(A4) S2.12(A4) S3.12(A4) U1.34(A4) U2.8(A4) U11.1(A) U12.1(A) U13.1(A)
A5: RP1.7 S1.11(A5) S2.11(A5) S3.11(A5) U1.35(A5) U2.7(A5) U11.2(B) U12.2(B) U13.2(B)
A6: RP1.8 S1.10(A6) S2.10(A6) S3.10(A6) U1.36(A6) U2.6(A6) U11.3(C) U12.3(C) U13.3(C)
A7: RP1.9 S1.9(A7) S2.9(A7) S3.9(A7) U1.37(A7) U2.5(A7) U11.5(G2B#) U12.5(G2B#) U13.5(G2B#)
A8: RP2.2 S1.8(A8) S2.8(A8) S3.8(A8) U1.38(A8) U2.27(A8)
A9: RP2.3 S1.7(A9) S2.7(A9) S3.7(A9) U1.39(A9) U2.26(A9)
A10: RP2.4 S1.6(A10) S2.6(A10) S3.6(A10) U1.40(A10) U2.23(A10)
A11: RP2.5 S1.5(A11) S2.5(A11) S3.5(A11) U1.1(A11) U2.25(A11)
A12: RP2.6 S1.4(A12) S2.4(A12) S3.4(A12) U1.2(A12) U2.4(A12)
A13: RP2.7 S1.3(A13) S2.3(A13) S3.3(A13) U1.3(A13) U2.28(A13)
A14: RP2.8 S1.2(A14) S2.2(A14) S3.2(A14) U1.4(A14) U2.3(A14)
A15: RP2.9 S1.1(A15) S2.1(A15) S3.1(A15) U1.5(A15) U3.4(2A) U3.5(2B)
AUDIO_OUT: M1.23(25-A1-D1) R36.1
B0: M1.5(A5-4) R19.2
B1: M1.8(SCK-5) R18.2
CEN1: S1.61(CLK2) U8.24(GPA3)
CEN2: S2.61(CLK2) U8.25(GPA4)
CEN3: S3.61(CLK2) U8.26(GPA5)
CLK: R58.1 S1.21(CLK) S2.21(CLK) S3.21(CLK) U1.6(CLK)
CPRES1: S1.60(PAGE) U8.21(GPA0)
CPRES2: S2.60(PAGE) U8.22(GPA1)
CPRES3: S3.60(PAGE) U8.23(GPA2)
D0: S1.27(D0) S2.27(D0) S3.27(D0) U1.14(D0) U2.12(IO1) U4.40(PA0)
D1: S1.28(D1) S2.28(D1) S3.28(D1) U1.15(D1) U2.13(IO2) U4.39(PA1)
D2: S1.29(D2) S2.29(D2) S3.29(D2) U1.12(D2) U2.14(IO3) U4.38(PA2)
D3: S1.30(D3) S2.30(D3) S3.30(D3) U1.8(D3) U2.17(IO4) U4.37(PA3)
D4: S1.31(D4) S2.31(D4) S3.31(D4) U1.7(D4) U2.18(IO5) U4.36(PA4)
D5: S1.32(D5) S2.32(D5) S3.32(D5) U1.9(D5) U2.19(IO6) U4.35(PA5)
D6: S1.33(D6) S2.33(D6) S3.33(D6) U1.10(D6) U2.20(IO7) U4.34(PA6)
D7: S1.34(D7) S2.34(D7) S3.34(D7) U1.13(D7) U2.21(IO8) U4.33(PA7)
D8: S1.67(D8) S2.67(D8) S3.67(D8)
D9: S1.68(D9) S2.68(D9) S3.68(D9)
D10: S1.69(D10) S2.69(D10) S3.69(D10)
D11: S1.70(D11) S2.70(D11) S3.70(D11)
D12: S1.71(D12) S2.71(D12) S3.71(D12)
D13: S1.72(D13) S2.72(D13) S3.72(D13)
D14: S1.73(D14) S2.73(D14) S3.73(D14)
D15: S1.74(D15) S2.74(D15) S3.74(D15)
DTR: C15.1 P1.4
G0: M1.9(MOSI-18) R21.2
G1: M1.10(MISO-19) R20.2
GPA0: S1.48(Pin48) S2.48(Pin48) S3.48(Pin48) U7.21(GPA0)
GPA1: S1.47(Pin47) S2.47(Pin47) S3.47(Pin47) U7.22(GPA1)
GPA2: S1.46(Pin46) S2.46(Pin46) S3.46(Pin46) U7.23(GPA2)
GPA3: S1.45(Pin45) S2.45(Pin45) S3.45(Pin45) U7.24(GPA3)
GPA4: S1.44(Pin44) S2.44(Pin44) S3.44(Pin44) U7.25(GPA4)
GPA5: S1.43(Pin43) S2.43(Pin43) S3.43(Pin43) U7.26(GPA5)
GPA6: S1.42(Pin42) S2.42(Pin42) S3.42(Pin42) U7.27(GPA6)
GPA7: S1.41(Pin41) S2.41(Pin41) S3.41(Pin41) U7.28(GPA7)
GPB0: S1.49(A23) S2.49(A23) S3.49(A23) U7.1(GPB0)
GPB1: S1.50(A22) S2.50(A22) S3.50(A22) U7.2(GPB1)
GPB2: S1.51(A21) S2.51(A21) S3.51(A21) U7.3(GPB2)
GPB3: S1.52(A20) S2.52(A20) S3.52(A20) U7.4(GPB3)
GPB4: S1.53(A19) S2.53(A19) S3.53(A19) U7.5(GPB4)
GPB5: S1.54(A18) S2.54(A18) S3.54(A18) U7.6(GPB5)
GPB6: S1.55(A17) S2.55(A17) S3.55(A17) U7.7(GPB6)
GPB7: S1.56(A16) S2.56(A16) S3.56(A16) U7.8(GPB7)
HSYNC: M1.15(SDA-23) R17.2
I_CAS1: S1.80(IEI) S2.40(IEO)
I_CAS2: S2.80(IEI) S3.40(IEO)
MISO: H2.3 H3.1(MISO) R37.2 U4.7(PB6)
MOSI: H2.4 H3.4(MOSI) U4.6(PB5)
PB0: R9.1 U3.13(AB) U4.1(PB0)
PB2: U2.30(CE2) U4.3(PB2)
PD3: D1.1 U4.17(PD3)
PD4: U3.2(1B) U4.18(PD4)
PS2_P0_CLK: M1.22(33-A9) R30.2
PS2_P0_DAT: M1.21(32-A7) R31.2
PS2_P1_CLK: M1.24(26-A0) R26.2
PS2_P1_DAT: M1.25(27-A10) R27.2
PS_ON_3V3: M1.26(14-A6) Q6.1(S) R48.2
PWR_OK: JP8.2 LED7.1 Q9.3(D) R55.2 U10.8
PWR_OK_3V3: M1.17(36-A4) Q9.1(S) R56.2
R0: M1.11(21) R23.2
R1: M1.14(SCL-22) R22.2
RAM_A15: U2.31(A15) U3.3(1Y)
RAM_A16: D1.2 D2.2 R3.2 U2.2(A16)
RUN: Q5.3(D) R44.2 U4.29(PC7)
RUN_3V3: M1.27(12-A11) Q5.1(S) R45.2
RX: JP3.1 Q3.3(D) R12.2 S1.36(RX) S2.36(RX) S3.36(RX)
RX2: S1.76(RX2) S2.76(RX2) S3.76(RX2)
RX_3V3: M1.19(34-A2) Q3.1(S) R13.2
RXD: H4.4 JP3.2 P1.2 U4.15(PD1)
SB_3V3: JP6.1 M1.29(3V) Q6.2(G) R48.1 SW3.1 SW3.2
SCK: H2.5 H3.3(SCK) JP9.1 LED6.1(A) R39.1 U4.8(PB7)
SCL: Q8.3(D) R43.1 R53.2 S1.38(USR2) S2.38(USR2) S3.38(USR2) U4.22(PC0) U5.6(SCL)
SCL_3V3: Q8.1(S) R54.2 U7.12(SCK) U8.12(SCK)
SDA: Q7.3(D) R42.1 R51.2 S1.37(USR1) S2.37(USR1) S3.37(USR1) U4.23(PC1) U5.5(SDA)
SDA_3V3: Q7.1(S) R52.2 U7.13(SDA) U8.13(SDA)
SS: H2.6 R38.2 R50.2 U4.5(PB4)
SYS_RESET: C15.2 D5.2 H3.5(RST) R40.2 R41.2 U4.9(RESET)
TX: JP4.1 Q4.3(D) R14.2 S1.35(TX) S2.35(TX) S3.35(TX)
TX2: S1.75(TX2) S2.75(TX2) S3.75(TX2)
TX_3V3: M1.3(2) Q4.1(S) R15.1
TXD: H4.5 JP4.2 P1.3 U4.14(PD0)
USER: R10.1 R11.1 U4.19(PD5)
VSYNC: M1.2(A8-15) R16.2
Net-(C4-1): C4.1 U4.12(XTAL2) X1.1(OSC1)
Net-(C5-2): C5.2 U4.13(XTAL1) X1.2(OSC2)
Net-(C6-1): C6.1 C12.1 R35.1 R36.2
Net-(C6-2): C6.2 LM386.3 R34.1
Net-(C7-1): C7.1 LM386.5 R32.1 R33.2
Net-(C7-2): C7.2 JP2.RING(RIGHT) JP2.TIP(LEFT)
Net-(C9-1): C9.1 R32.2
Net-(C10-1): C10.1 LM386.1
Net-(C10-2): C10.2 R33.1
Net-(C11-1): C11.1 LM386.7
Net-(CR2032-1): CR2032.1 U5.3(VBAT)
Net-(D2-1): D2.1 U3.1(1A) U3.6(2Y)
Net-(D3-1): D3.1(K) JP10.1 LED4.1(A)
Net-(D4-1): D4.1(K) R50.1
Net-(D4-2): D4.2(A) JP9.2 LED6.2(K)
Net-(H1-2): H1.2 H1.3 JP1.2 M1.34(V+) M1.35(45)
Net-(H1-4): H1.4 M1.33(RX)
Net-(H1-5): H1.5 M1.32(TX)
Net-(H1-6): H1.6 M1.31
Net-(JP6-2): JP6.2 M1.18(39-A3) R57.1 SW3.3 SW3.4
Net-(JP7-2): JP7.2 R10.2 SW1.3 SW1.4
Net-(JP10-2): JP10.2 LED4.2(K) R11.2
Net-(KEYBOARD-1): KEYBOARD.1(DATA) R29.1 R31.1
Net-(KEYBOARD-5): KEYBOARD.5(CLK) R28.1 R30.1
Net-(LED1-1): LED1.1(A) U3.8(3Y) U3.12(4A)
Net-(LED1-2): LED1.2(K) R2.1
Net-(LED2-1): LED2.1(A) R5.1
Net-(LED3-1): LED3.1(A) R7.1
Net-(LED5-1): LED5.1(A) R9.2
Net-(LED7-2): LED7.2 R46.1
Net-(MOUSE-1): MOUSE.1(DATA) R25.1 R27.1
Net-(MOUSE-5): MOUSE.5(CLK) R24.1 R26.1
Net-(Q1-2): Q1.2(B) R4.2
Net-(Q1-3): Q1.3(C) R5.2
Net-(Q2-2): Q2.2(B) R6.2
Net-(Q2-3): Q2.3(C) R7.2
Net-(R16-1): R16.1 VGA.14
Net-(R17-1): R17.1 VGA.13
Net-(R18-1): R18.1 R19.1 VGA.3
Net-(R20-1): R20.1 R21.1 VGA.2
Net-(R22-1): R22.1 R23.1 VGA.1
Net-(R49-1): R49.1 U7.18(RESET#)
Net-(R58-2): R58.2 U4.21(PD7)
Net-(R59-1): R59.1 U8.18(RESET#)
Net-(SPK-1): SPK.1(+) U4.16(PD2)
Net-(U5-1): U5.1(X1) X2.2
Net-(U5-2): U5.2(X2) X2.1

Not connected (* = marked no-connect by the designer): H4 2* 6*; KEYBOARD 2(NC)* 6(NC)*; LM386 8; M1 1(Bat)* 4(0)* 6(S1RX-16)* 7(S1TX-17)* 12(RX)* 13(TX)* 20(35-A13)* 28(13-A12)*; MOUSE 2(NC)* 6(NC)*; P1 1* 6* 7* 8* 9*; S1 40(IEO)*; S3 80(IEI)*; U2 1(NC)*; U4 32(AREF)*; U5 7(SQW/OUT)*; U7 11(NC)* 14(NC)* 19(INTB)* 20(INTA)*; U8 1(GPB0)* 2(GPB1)* 3(GPB2)* 4(GPB3)* 5(GPB4)* 6(GPB5)* 7(GPB6)* 8(GPB7)* 11(NC)* 14(NC)* 19(INTB)* 20(INTA)* 27(GPA6)* 28(GPA7)*; U10 14* 20*; U11 7(Y7)* 9(Y6)* 10(Y5)* 11(Y4)* 12(Y3)*; U12 7(Y7)* 9(Y6)* 10(Y5)* 11(Y4)* 12(Y3)*; U13 7(Y7)* 9(Y6)* 10(Y5)* 11(Y4)* 12(Y3)*; VGA 4* 9* 11* 12* 15*

## Notes on the sheets
sheet 1
- RAM_CE2
- CLK
- /RESET
- /INT
- /BUSREQ
- BANK0
- /RD
- /WR
- /MREQ
- A0
- BANK1
- /WAIT
- /WAIT_RES
sheet 2
- /WAIT_RES
- /INT
- RAM_CE2
- /WAIT
- /RESET
- /MREQ
- /RD
- /WR
- BANK0
- BANK1
- A0
- /BUSREQ
- CLK
- ViCREM
- RTC
sheet 3
- MCU & SERIAL COMM. SECTION
- KAMVA
- VGA SECTION
- ATX PWR SECTION
sheet 4
- PS/2 KEYBOARD & MOUSE SECTION
- AMPLIFIED MONO AUDIO SECTION
sheet 5
- Reserved I2C Addresses
- 0x68 - RTC
- 0x20 - IOEXP
- 0x21 - CyBorgSPP
- 0x22 - BUSCTLR
- IOEXP
- BUSCTLR
- EN MUX
- RD MUX
- WR MUX
sheet 6
- Use caution when using add-on cards designed for RC2014!!
- IEI
- IEO
- IEI
- IEO
- IEI
- IEO
- BP-80E is an unofficial variant of the RC2014 bus. BP-80E is essentially a modification
  of the RC80 bus which is also an unofficial RC2014 bus variant. The major differences
  are: A16-A23 are instead assigned to GPB0-7, n41-n48 are instead assigned to GPA0-7,
  pins 60 & 61 are used for detection, and USER pins are assigned to extra power pins
  and(much like RC80) I2C bus, and interrupt cascade. This creates the potential danger
  when using cards designed for RC2014 and the like:
  If the add-on doesn't expect power on the USER pins (for example), you could fry the
  board or worse. Any add-on card that just uses the traditional power pins, address bus,
  data bus, and control signals should work fine and, of course, any boards specifically
  designed for the BP-80E bus should also be fine. In a future version I may change this
  to an entirely different slot type to avoid potential problems.
- I2C Bus Term On Slot 3
